# Altium schematic sheet TEMPO_microcontrolleur.SchDoc: OUAIS
size A3; ApprovedBy: WATTEU; Author: watteu; DrawnBy: WATTEU; SheetNumber: 2; SheetTotal: 3
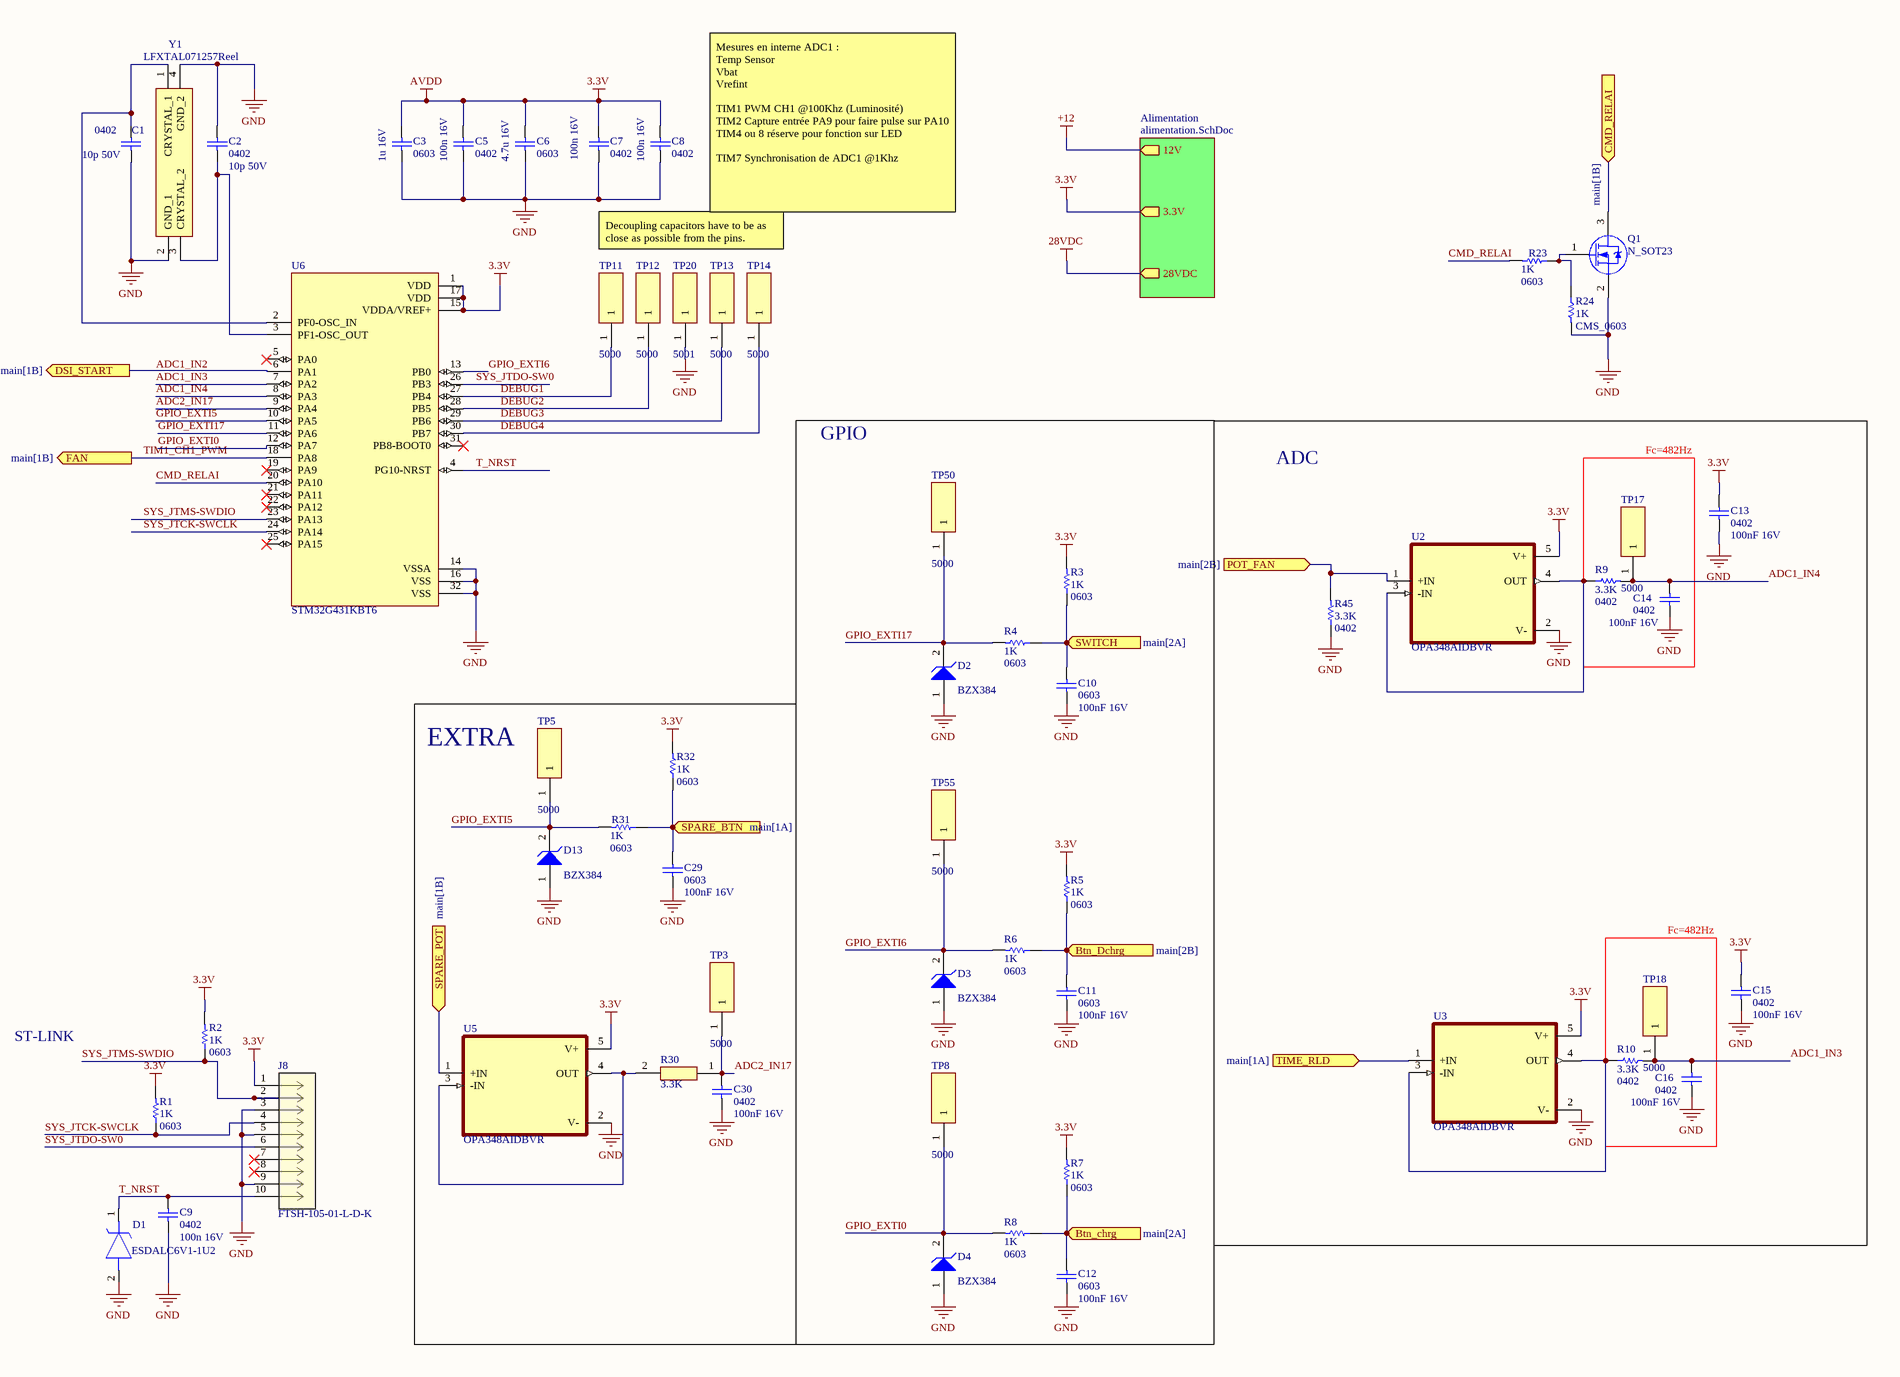
[diagram p0: TEMPO_microcontrolleur.SchDoc, right]

## Parts
C1  value 10p 50V  Type: 0402  [CONDENSATEUR_CMS_0402]  (hidden comment: CMS_0402)
C2  value 10p 50V  Type: 0402  [CONDENSATEUR_CMS_0402]  (hidden comment: CMS_0402)
C3  value 1u 16V  Type: 0603  [CONDENSATEUR_CMS_0603]  (hidden comment: CMS_0603)
C5  value 100n 16V  Type: 0402  [CONDENSATEUR_CMS_0402]  (hidden comment: CMS_0402)
C6  value 4.7u 16V  Type: 0603  [CONDENSATEUR_CMS_0603]  (hidden comment: CMS_0603)
C7  value 100n 16V  Type: 0402  [CONDENSATEUR_CMS_0402]  (hidden comment: CMS_0402)
C8  value 100n 16V  Type: 0402  [CONDENSATEUR_CMS_0402]  (hidden comment: CMS_0402)
C9  value 100n 16V  Type: 0402  [CONDENSATEUR_CMS_0402]  (hidden comment: CMS_0402)
C10  value 100nF 16V  Type: 0603  [CONDENSATEUR_CMS_0603]  (hidden comment: CMS_0603)
C11  value 100nF 16V  Type: 0603  [CONDENSATEUR_CMS_0603]  (hidden comment: CMS_0603)
C12  value 100nF 16V  Type: 0603  [CONDENSATEUR_CMS_0603]  (hidden comment: CMS_0603)
C13  value 100nF 16V  Type: 0402  [CONDENSATEUR_CMS_0402]  (hidden comment: CMS_0402)
C14  value 100nF 16V  Type: 0402  [CONDENSATEUR_CMS_0402]  (hidden comment: CMS_0402)
C15  value 100nF 16V  Type: 0402  [CONDENSATEUR_CMS_0402]  (hidden comment: CMS_0402)
C16  value 100nF 16V  Type: 0402  [CONDENSATEUR_CMS_0402]  (hidden comment: CMS_0402)
C29  value 100nF 16V  Type: 0603  [CONDENSATEUR_CMS_0603]  (hidden comment: CMS_0603)
C30  value 100nF 16V  Type: 0402  [CONDENSATEUR_CMS_0402]  (hidden comment: CMS_0402)
D1  ESDALC6V1-1U2  [PZU68B1AQX]
D2  Type: BZX384  [DIODE_CMS_SOD323]  (hidden comment: DIODE_CMS_ZENER_SOD323 : BZX384)
D3  Type: BZX384  [DIODE_CMS_SOD323]  (hidden comment: DIODE_CMS_ZENER_SOD323 : BZX384)
D4  Type: BZX384  [DIODE_CMS_SOD323]  (hidden comment: DIODE_CMS_ZENER_SOD323 : BZX384)
D13  Type: BZX384  [DIODE_CMS_SOD323]  (hidden comment: DIODE_CMS_ZENER_SOD323 : BZX384)
J8  FTSH-105-01-L-D-K  [CONN_FTSH-105-01-L-D-K_SAI]
Q1  Package: N_SOT23  [TRANSISTOR_MOSFET-N_SOT23_GSD]  (hidden comment: TRANSISTOR_MOSFET-N_SOT23_GSD)
R1  value 1K  Type: 0603  [RESISTANCE_CMS_0603]  (hidden comment: RESISTANCE_CMS_0603)
R2  value 1K  Type: 0603  [RESISTANCE_CMS_0603]  (hidden comment: RESISTANCE_CMS_0603)
R3  value 1K  Type: 0603  [RESISTANCE_CMS_0603]  (hidden comment: RESISTANCE_CMS_0603)
R4  value 1K  Type: 0603  [RESISTANCE_CMS_0603]  (hidden comment: RESISTANCE_CMS_0603)
R5  value 1K  Type: 0603  [RESISTANCE_CMS_0603]  (hidden comment: RESISTANCE_CMS_0603)
R6  value 1K  Type: 0603  [RESISTANCE_CMS_0603]  (hidden comment: RESISTANCE_CMS_0603)
R7  value 1K  Type: 0603  [RESISTANCE_CMS_0603]  (hidden comment: RESISTANCE_CMS_0603)
R8  value 1K  Type: 0603  [RESISTANCE_CMS_0603]  (hidden comment: RESISTANCE_CMS_0603)
R9  value 3.3K  Type: 0402  [RESISTANCE_CMS_0805]  (hidden comment: RESISTANCE_CMS_0805)
R10  value 3.3K  Type: 0402  [RESISTANCE_CMS_0805]  (hidden comment: RESISTANCE_CMS_0805)
R23  value 1K  Type: 0603  [RESISTANCE_CMS_0603]  (hidden comment: RESISTANCE_CMS_0603)
R24  value 1K  Type: CMS_0603  [RESISTANCE_CMS_0603]  (hidden comment: RESISTANCE_CMS_0603)
R30  3.3K  [RESC1005X40N]
R31  value 1K  Type: 0603  [RESISTANCE_CMS_0603]  (hidden comment: RESISTANCE_CMS_0603)
R32  value 1K  Type: 0603  [RESISTANCE_CMS_0603]  (hidden comment: RESISTANCE_CMS_0603)
R45  value 3.3K  Type: 0402  [RESISTANCE_CMS_0805]  (hidden comment: RESISTANCE_CMS_0805)
TP3  5000  [5000]
TP5  5000  [5000]
TP8  5000  [5000]
TP11  5000  [5000]
TP12  5000  [5000]
TP13  5000  [5000]
TP14  5000  [5000]
TP17  5000  [5000]
TP18  5000  [5000]
TP20  5001  [5000]
TP50  5000  [5000]
TP55  5000  [5000]
U2  OPA348AIDBVR  [SOT95P280X145-5N]
U3  OPA348AIDBVR  [SOT95P280X145-5N]
U5  OPA348AIDBVR  [SOT95P280X145-5N]
U6  STM32G431KBT6  [QFP80P900X900X160-32N]
Y1  LFXTAL071257Reel  [LFXTAL071257Reel]

## Blocks framed on the sheet
Fc=482Hz: C14 R9 TP17
Fc=482Hz: C16 R10 TP18

## Sub-sheets
Alimentation = alimentation.SchDoc: 12V (out), 3.3V (out), 28VDC (out)

## Ports
Btn_chrg (in, see main[2A]), Btn_Dchrg (in, see main[2B]), CMD_RELAI (in, see main[1B]), DSI_START (out, see main[1B]), FAN (out, see main[1B]), POT_FAN (in, see main[2B]), SPARE_BTN (in, see main[1A]), SPARE_POT (in, see main[1B]), SWITCH (in, see main[2A]), TIME_RLD (in, see main[1A])

## Nets
3.3V: C3.2 C5.2 C6.2 C7.2 C8.2 C13.2 C15.2 J8.1 R1.2 R2.2 R3.2 R5.2 R7.2 R32.2 U2.5(V+) U3.5(V+) U5.5(V+) U6.1(VDD) U6.15(VDDA/VREF+) U6.17(VDD) ; sheet Alimentation/3.3V  [also labelled AVDD]
28VDC: sheet Alimentation/28VDC
+12: sheet Alimentation/12V
GND: C1.1 C2.2 C3.1 C5.1 C6.1 C7.1 C8.1 C9.1 C10.1 C11.1 C12.1 C13.1 C14.1 C15.1 C16.1 C29.1 C30.1 D1.2(A) D2.1 D3.1 D4.1 D13.1 J8.3 J8.5 J8.9 Q1.2(S) R24.2 R45.1 TP20.1 U2.2(V-) U3.2(V-) U5.2(V-) U6.14(VSSA) U6.16(VSS) U6.32(VSS) Y1.2(GND_1) Y1.4(GND_2)
ADC1_IN3: C16.2 R10.2 TP18.1 U6.7(PA2)
ADC1_IN4: C14.2 R9.2 TP17.1 U6.8(PA3)
ADC2_IN17: C30.2 R30.1 TP3.1 U6.9(PA4)
Btn_chrg: C12.2 R7.1 R8.1 ; port Btn_chrg
Btn_Dchrg: C11.2 R5.1 R6.1 ; port Btn_Dchrg
CMD_RELAI: R23.2 U6.20(PA10)
CMD_RELAI: Q1.3(D) ; port CMD_RELAI  [a separate net that carries the same name]
DEBUG1: TP11.1 U6.27(PB4)
DEBUG2: TP12.1 U6.28(PB5)
DEBUG3: TP13.1 U6.29(PB6)
DEBUG4: TP14.1 U6.30(PB7)
DSI_START: U6.6(PA1) ; port DSI_START
GPIO_EXTI0: D4.2 R8.2 TP8.1 U6.12(PA7)
GPIO_EXTI5: D13.2 R31.2 TP5.1 U6.10(PA5)
GPIO_EXTI6: D3.2 R6.2 TP55.1 U6.13(PB0)
GPIO_EXTI17: D2.2 R4.2 TP50.1 U6.11(PA6)
POT_FAN: R45.2 U2.1(+IN) ; port POT_FAN
SPARE_BTN: C29.2 R31.1 R32.1 ; port SPARE_BTN
SPARE_POT: U5.1(+IN) ; port SPARE_POT
SWITCH: C10.2 R3.1 R4.1 ; port SWITCH
SYS_JTCK-SWCLK: J8.4 R1.1 U6.24(PA14)
SYS_JTDO-SW0: J8.6 U6.26(PB3)
SYS_JTMS-SWDIO: J8.2 R2.1 U6.23(PA13)
T_NRST: C9.2 D1.1(K) J8.10 U6.4(PG10-NRST)
TIM1_CH1_PWM: U6.18(PA8) ; port FAN
TIME_RLD: U3.1(+IN) ; port TIME_RLD
NetC1_2: C1.2 U6.2(PF0-OSC_IN) Y1.1(CRYSTAL_1)
NetC2_1: C2.1 U6.3(PF1-OSC_OUT) Y1.3(CRYSTAL_2)
NetQ1_1: Q1.1(G) R23.1 R24.1
NetR9_1: R9.1 U2.3(-IN) U2.4(OUT)
NetR10_1: R10.1 U3.3(-IN) U3.4(OUT)
NetR30_2: R30.2 U5.3(-IN) U5.4(OUT)

Not connected (* = marked no-connect by the designer): J8 7* 8*; U6 5(PA0)* 19(PA9)* 21(PA11)* 22(PA12)* 25(PA15)* 31(PB8-BOOT0)*

## Notes on the sheet
- Mesures en interne ADC1 :
  Temp Sensor
  Vbat
  Vrefint
  TIM1 PWM CH1 @100Khz (Luminosité)
  TIM2 Capture entrée PA9 pour faire pulse sur PA10
  TIM4 ou 8 réserve pour fonction sur LED
  TIM7 Synchronisation de ADC1 @1Khz
- Decoupling capacitors have to be as close as possible from the pins.
- GPIO
- ADC
- EXTRA
- ST-LINK
- Labels drawn without touching a wire or pin: ADC1_IN2

## Library data of the parts
C1 C2 C5 C7-C9 C13-C16 C30 = CONDENSATEUR_CMS_CER_0402: CONDENSATEUR CMS CERAMIQUE 0402
C3 C6 C10-C12 C29 = CONDENSATEUR_CMS_CER_0603: CONDENSATEUR CMS CERAMIQUE 0603
D1 = PZU6.8B1A-QX: Zener Diode; Manufacturer_Name: Nexperia; Datasheet Link: https://assets.nexperia.com/documents/data-sheet/PZUXBA-Q_SER.pdf; Height: 1.1mm; Manufacturer_Part_Number: PZU6.8B1A-QX
J8 = FTSH-105-01-L-D-K: No Description Available; Mfr_Name: Samtec Inc; Digi-Key_Part_Number_1: SAM8798-ND; RefDes: RefDes; Type: Type
Q1 = TRANSISTOR_MOSFET-N_SOT23_GSD: TRANSISTOR MOSFET CANAL N BOITIER SOT23_GSD
R1-R8 R23 R24 R31 R32 = RESISTANCE_CMS_0603: RESISTANCE CMS 0603
R9 R10 R45 = RESISTANCE_CMS_0805: RESISTANCE CMS 0805
R30 = CRCW04020000Z0ED: Resistor; Manufacturer_Name: Vishay; Allied_Number: 70202079; Datasheet Link: http://uk.rs-online.com/web/p/products/2508364793; Height: 0.4mm; RS Part Number: 2508364793; RS Price/Stock: http://uk.rs-online.com/web/p/products/2508364793; Manufacturer_Part_Number: CRCW04020000Z0ED
TP3 TP5 TP8 TP11-TP14 TP17 TP18 TP20 TP50 TP55 = 5000: Connector; Manufacturer_Name: Keystone Electronics; Datasheet Link: http://www.keyelco.com/product-pdf.cfm?p=1309; Manufacturer_Part_Number: 5000; Mouser Part Number: 534-5000; Mouser Price/Stock: https://www.mouser.co.uk/ProductDetail/Keystone-Electronics/5000?qs=q0tsjPZWdm%252B9SiiTAbEwUw%3D%3D; Arrow Part Number: 5000; Arrow Price/Stock: https://www.arrow.com/en/products/5000/keystone-electronics?region=europe
U2 U3 U5 = OPA348AIDBVR: 1MHz, 45uA, RRIO, Single Op Amp 5-SOT-23 -40 to 125; MF: Texas Instruments; Package: SOT-23-5 Texas Instruments; Value: *; MP: OPA348AIDBVR; Texas_Instruments-Purchase-URL: https://snapeda.com/shop?store=Texas+Instruments&id=560751; DigiKey-Purchase-URL: https://snapeda.com/shop?store=DigiKey&id=560751; Arrow_Electronics-Purchase-URL: https://snapeda.com/shop?store=Arrow+Electronics&id=560751; Mouser-Purchase-URL: https://snapeda.com/shop?store=Mouser&id=560751; Digi-Key_Part_Number: 296-26277-1-ND; SnapEDA_Link: https://www.snapeda.com/parts/OPA348AIDBVR/Texas%20Instruments/view-part/560751/?ref=snap
U6 = STM32G431KBT6: ARMÂ® CortexÂ®-M4F STM32G4 Microcontroller IC 32-Bit 170MHz 128KB _128K x 8_ FLASH 32-LQFP _7x7_; MF: STMicroelectronics; Price: None; SnapEDA_Link: https://www.snapeda.com/parts/STM32G431KBT6/STMicroelectronics/view-part/4422336/?ref=snap; MP: STM32G431KBT6; Availability: Unavailable; Value: *; Package: LQFP-32 STMicroelectronics
Y1 = LFXTAL071257Reel: Crystal or Oscillator; Manufacturer_Name: IQD; Datasheet Link: https://www.iqdfrequencyproducts.com/products/pn/LFXTAL071257Reel.pdf; Height: 0.5mm; Manufacturer_Part_Number: LFXTAL071257Reel; Mouser Part Number: 449-LFXTAL071257REEL; Mouser Price/Stock: https://www.mouser.co.uk/ProductDetail/IQD/LFXTAL071257Reel?qs=nFovR%252B4R4UNJEiCmxCmq2g%3D%3D